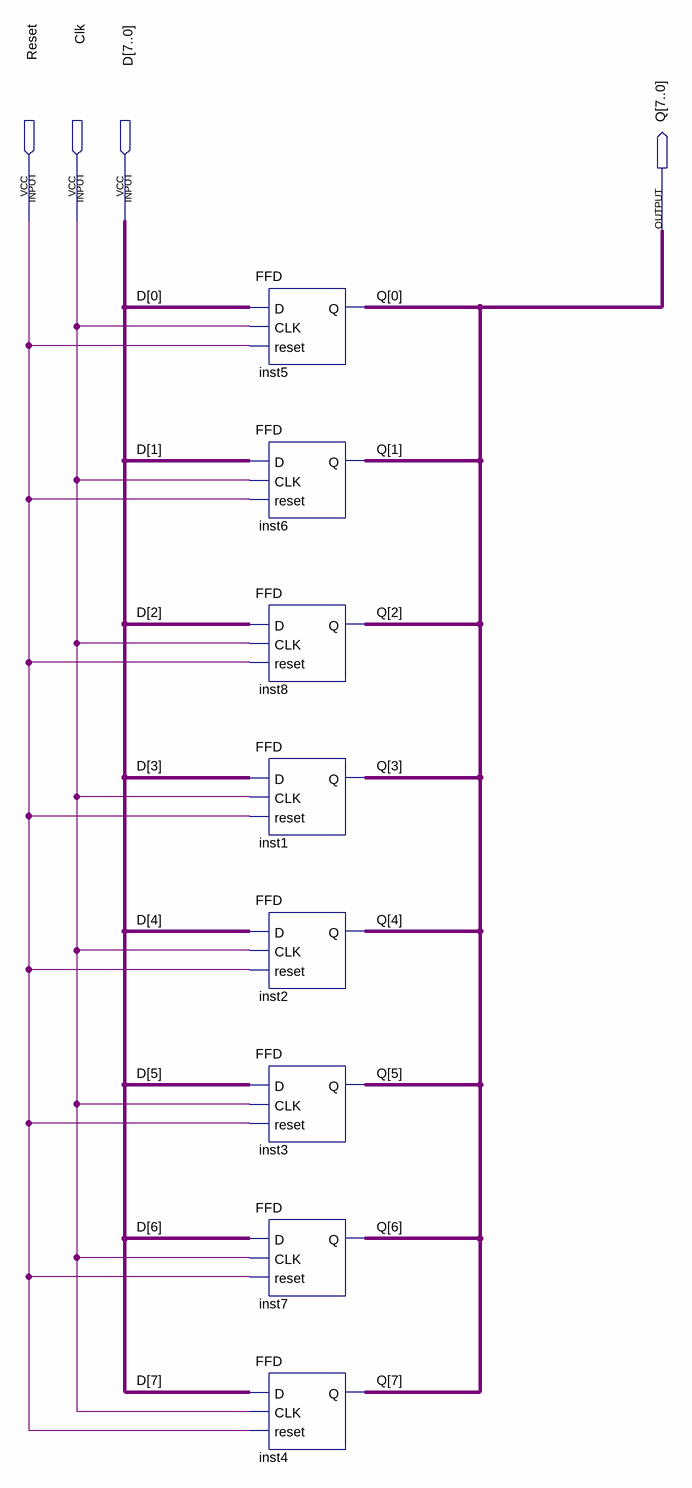
[diagram p0: schematic sheet]
// Quartus schematic REG8BIT.bdf as structural Verilog: 8 symbols, 4 pins
module REG8BIT (
  input  Reset,
  input  Clk,
  input  [7:0] D,
  output [7:0] Q
);

  FFD inst5 (.D(D[0]), .CLK(Clk), .reset(Reset), .Q(Q[0]));
  FFD inst6 (.D(D[1]), .CLK(Clk), .reset(Reset), .Q(Q[1]));
  FFD inst8 (.D(D[2]), .CLK(Clk), .reset(Reset), .Q(Q[2]));
  FFD inst1 (.D(D[3]), .CLK(Clk), .reset(Reset), .Q(Q[3]));
  FFD inst2 (.D(D[4]), .CLK(Clk), .reset(Reset), .Q(Q[4]));
  FFD inst3 (.D(D[5]), .CLK(Clk), .reset(Reset), .Q(Q[5]));
  FFD inst7 (.D(D[6]), .CLK(Clk), .reset(Reset), .Q(Q[6]));
  FFD inst4 (.D(D[7]), .CLK(Clk), .reset(Reset), .Q(Q[7]));
endmodule
